# EAGLE design M_C_ext_main_ftdi (EAGLE 9.6.2)
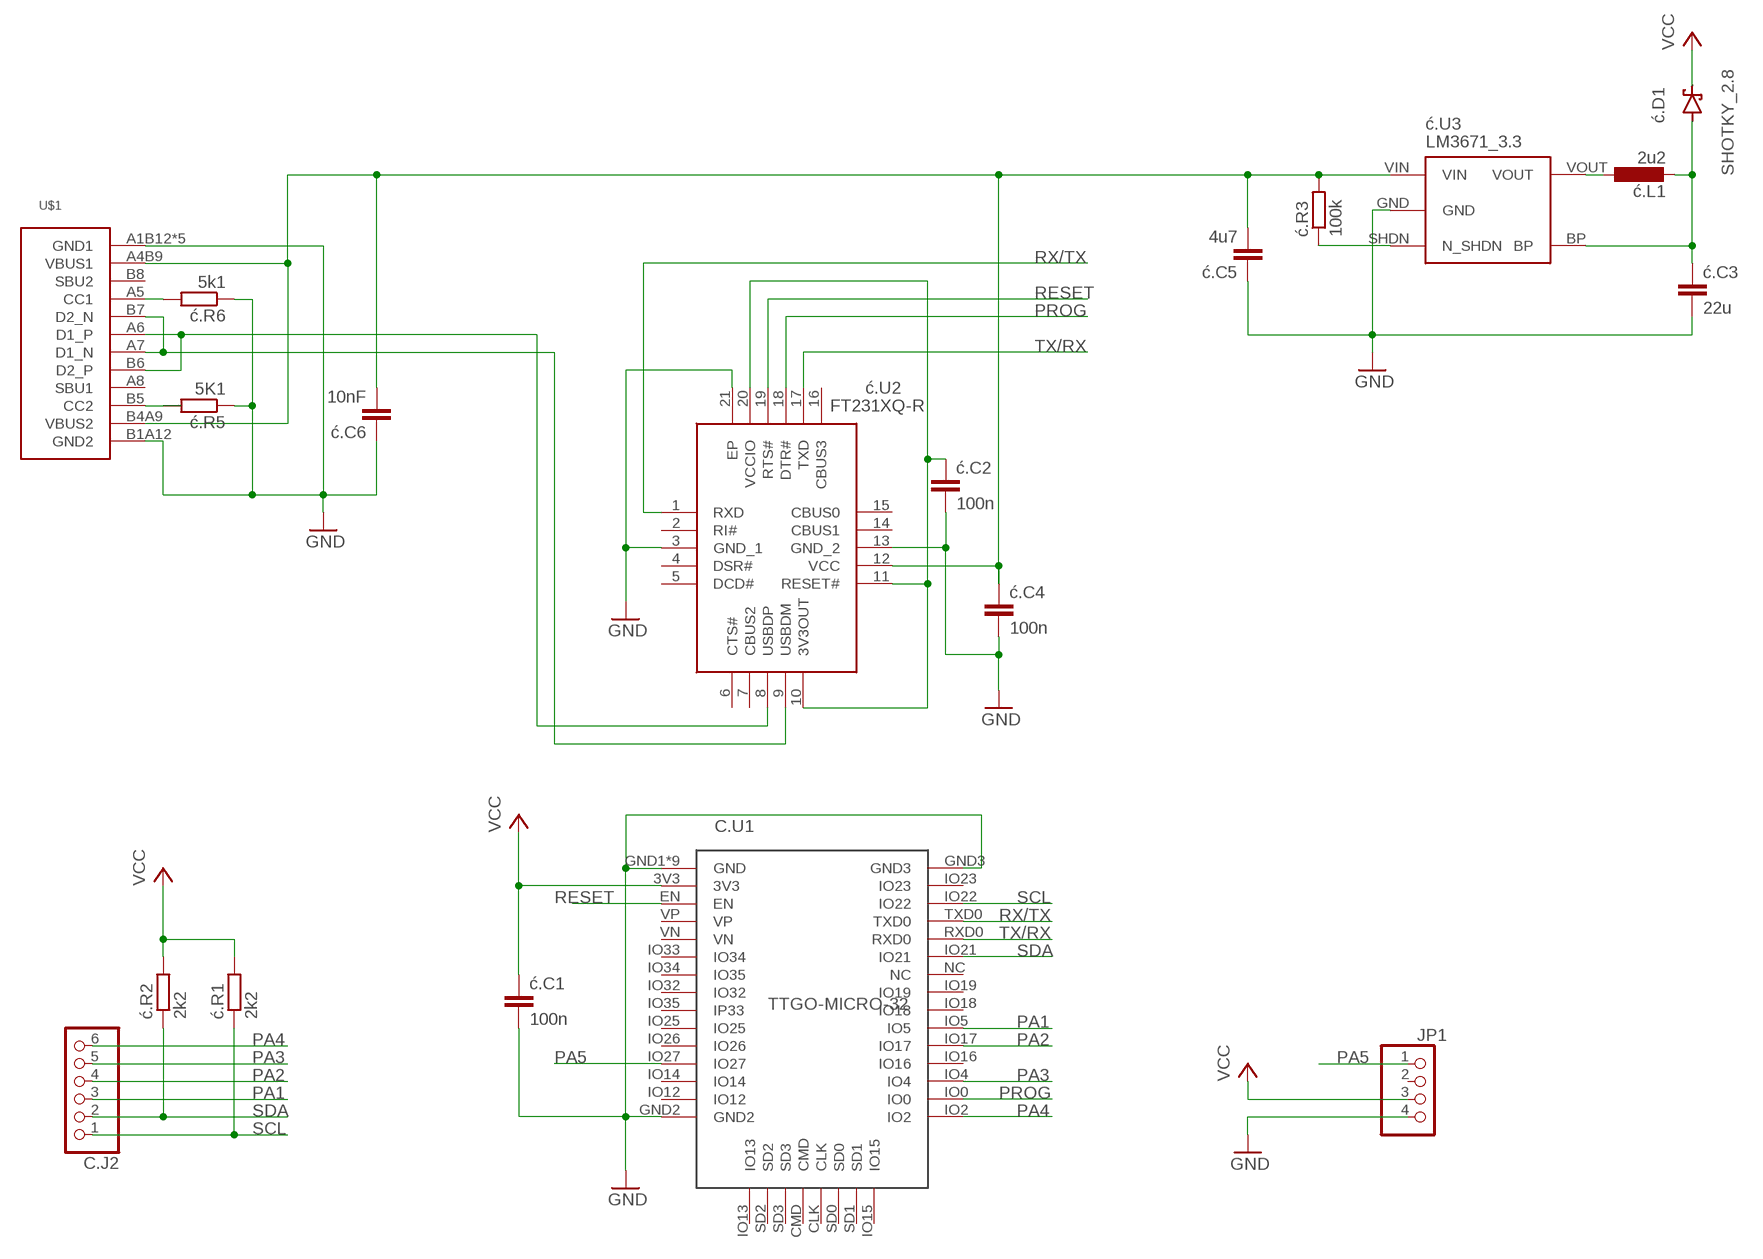
[diagram p0: schematic, sheet 1]

## Parts
C.J2  PINHD-1X6  [1X06]
C.U1  TTGO-MICRO-32  [TTGO-MICRO-32]
JP1  PINHD-1X4  [1X04]
U$1  USB-C  [USB-C]
ć.C1  100n  C-EUC0603  [C0603]
ć.C2  100n  C-EUC0603  [C0603]
ć.C3  22u  C-EUC0805  [C0805]
ć.C4  100n  C-EUC0603  [C0603]
ć.C5  4u7  C-EUC0603  [C0603]
ć.C6  10nF  C-EUC0603  [C0603]
ć.D1  SHOTKY_2.8  [SHOTKY_2.8]
ć.L1  2u2  L-EUL3230M  [L3230M]
ć.R1  2k2  R-EU_R0603  [R0603]
ć.R2  2k2  R-EU_R0603  [R0603]
ć.R3  100k  R-EU_R0603  [R0603]
ć.R5  5K1  R-EU_R0603  [R0603]
ć.R6  5k1  R-EU_R0603  [R0603]
ć.U2  FT231XQ-R  [QFN50P400X400X80-21N]
ć.U3  LM3671_3.3  STABILISER_APE8865  [SOT32-5]

## Nets
GND: C.U1.GND1(GND) C.U1.GND2 C.U1.GND3 C.U1.GND4(GND) C.U1.GND5(GND) C.U1.GND6(GND) C.U1.GND7(GND) C.U1.GND8(GND) C.U1.GND9(GND) C.U1.GND10(GND) C.U1.GND11(GND) JP1.4 U$1.A1B12(GND1) U$1.B1A12(GND2) U$1.SH1(GND1) U$1.SH2(GND1) U$1.SH3(GND1) U$1.SH4(GND1) ć.C1.2 ć.C2.2 ć.C3.2 ć.C4.2 ć.C5.1 ć.C6.1 ć.R5.1 ć.R6.1 ć.U2.3(GND_1) ć.U2.13(GND_2) ć.U2.21(EP) ć.U3.GND
N$1: U$1.A7(D1_N) U$1.B7(D2_N) ć.U2.9(USBDM)
N$2: U$1.A6(D1_P) U$1.B6(D2_P) ć.U2.8(USBDP)
N$3: U$1.A5(CC1) ć.R6.2
N$4: U$1.B5(CC2) ć.R5.2
N$5: ć.C3.1 ć.D1.A ć.L1.2 ć.U3.BP
N$10: ć.L1.1 ć.U3.VOUT
N$11: ć.R3.1 ć.U3.SHDN(N_SHDN)
N$15: ć.C2.1 ć.U2.10(3V3OUT) ć.U2.11(RESET#) ć.U2.20(VCCIO)
PA1: C.J2.3 C.U1.IO5
PA2: C.J2.4 C.U1.IO17
PA3: C.J2.5 C.U1.IO4
PA4: C.J2.6 C.U1.IO2
PA5: C.U1.IO27 JP1.1
PROG: C.U1.IO0 ć.U2.18(DTR#)
RESET: C.U1.EN ć.U2.19(RTS#)
RX/TX: C.U1.TXD0 ć.U2.1(RXD)
SCL: C.J2.1 C.U1.IO22 ć.R1.1
SDA: C.J2.2 C.U1.IO21 ć.R2.1
TX/RX: C.U1.RXD0 ć.U2.17(TXD)
VCC: C.U1.3V3 JP1.3 ć.C1.1 ć.D1.K(C) ć.R1.2 ć.R2.2
VUSB: U$1.A4B9(VBUS1) U$1.B4A9(VBUS2) ć.C4.1 ć.C5.2 ć.C6.2 ć.R3.2 ć.U2.12(VCC) ć.U3.VIN
Unconnected: C.U1.CLK C.U1.CMD C.U1.IO12 C.U1.IO13 C.U1.IO14 C.U1.IO15 C.U1.IO16 C.U1.IO18 C.U1.IO19 C.U1.IO23 C.U1.IO25 C.U1.IO26 C.U1.IO32 C.U1.IO33(IO34) C.U1.IO34(IO35) C.U1.IO35(IP33) C.U1.NC C.U1.SD0 C.U1.SD1 C.U1.SD2 C.U1.SD3 C.U1.VN C.U1.VP JP1.2 U$1.A8(SBU1) U$1.B8(SBU2) ć.U2.2(RI#) ć.U2.4(DSR#) ć.U2.5(DCD#) ć.U2.6(CTS#) ć.U2.7(CBUS2) ć.U2.14(CBUS1) ć.U2.15(CBUS0) ć.U2.16(CBUS3)

## Library data of the parts
C.J2 = pinhead2:PINHD-1X6: PIN HEADER
C.U1 = hugo:TTGO-MICRO-32
JP1 = pinhead2:PINHD-1X4: PIN HEADER
U$1 = hugo:USB-C
ć.C1-ć.C6 = rcl:C-EU: CAPACITOR, European symbol; SPICEPREFIX: C
ć.D1 = hugo:SHOTKY_2.8
ć.L1 = rcl:L-EU: INDUCTOR, European symbol; SPICEPREFIX: L
ć.R1-ć.R3 ć.R5 ć.R6 = rcl:R-EU_: RESISTOR, European symbol; SPICEPREFIX: R
ć.U2 = FT231XQ-R:FT231XQ-R: FTDI Chip FT231XQ-R, USB Transceiver Source: Datasheet <http://www.ftdichip.com/Support/Documents/DataSheets/ICs/DS_FT231X.pdf>; DESCRIPTION: FTDI Chip FT231XQ-R, USB Transceiver; HEIGHT: 0.8mm; MANUFACTURER_NAME: FTDI Chip; MANUFACTURER_PART_NUMBER: FT231XQ-R
ć.U3 = !stavebnice03:STABILISER_APE8865

## Board
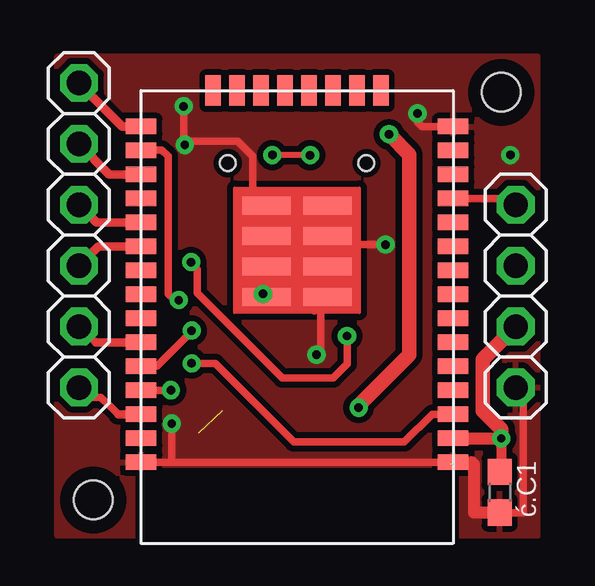
[diagram p1: board, top side]
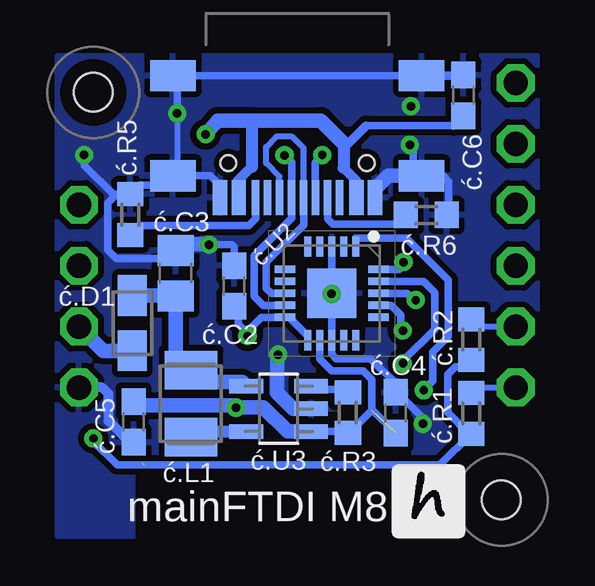
[diagram p2: board, bottom side, seen from below]

No outline drawn. Coordinates in mm, seen from the top.
Copper layers (1*16): Top 0.035mm / dielectric 1.5mm / Bottom 0.035mm
Design rules "default *": minimum track width 10mil, minimum drill 0.35mm, track to track 6mil, track to pad 6mil, pad to pad 6mil, via to via 10mil, smd to smd 10mil, copper to edge 10mil, drill to drill 40mil, minimum pad ring 10mil, minimum via ring 8mil, stop-mask expansion 4mil, vias tented up to drill 4mm, thermal gap 10mil
Holes 1.6 mm at 2,2 19,19
tRestrict: area 18,18 to 20,20; area 1,1 to 3,3
bRestrict: area 1,1 to 3,3; area 18,18 to 20,20

### Footprints (pad centres in the part's own frame; a part is rotated, then mirrored left to right if it is on the bottom)
1X06 = drill 1.016 pad 1.575 octagon: 1 -6.35,0; 2 -3.81,0; 3 -1.27,0; 4 1.27,0; 5 3.81,0; 6 6.35,0
TTGO-MICRO-32 = smd 1.27 x 0.635: 3V3 -6.5,5; EN -6.5,4; GND1 -6.5,6; GND2 -6.5,-8; GND3 6.5,6; IO0 6.5,-7; IO2 6.5,-8; IO4 6.5,-6; IO5 6.5,-3; IO12 -6.5,-7; IO14 -6.5,-6; IO16 6.5,-5; IO17 6.5,-4; IO18 6.5,-2; IO19 6.5,-1; IO21 6.5,1; IO22 6.5,4; IO23 6.5,5; IO25 -6.5,-3; IO26 -6.5,-4; IO27 -6.5,-5; IO32 -6.5,-1; IO33 -6.5,-2; IO34 -6.5,1; IO35 -6.5,0; NC 6.5,0; RXD0 6.5,2; TXD0 6.5,3; VN -6.5,2; VP -6.5,3 | smd 0.635 x 1.27: CLK 0.5,-9.5; CMD -0.5,-9.5; IO13 -3.5,-9.5; IO15 3.5,-9.5; SD0 1.5,-9.5; SD1 2.5,-9.5; SD2 -2.5,-9.5; SD3 -1.5,-9.5 | smd 2.032 x 0.762: GND4 -1.27,-0.889; GND5 1.27,-0.889; GND6 -1.27,-2.159; GND7 1.27,-2.159; GND8 -1.27,-3.429; GND9 -1.27,-4.699; GND10 1.27,-3.429; GND11 1.27,-4.699
1X04 = drill 1.016 pad 1.575 octagon: 1 -3.81,0; 2 -1.27,0; 3 1.27,0; 4 3.81,0
USB-C = smd 0.6 x 1.45: A1B12 -3.235,3.825; A4B9 -2.46,3.825; B1A12 3.215,3.825; B4A9 2.44,3.825 | smd 0.3 x 1.45: A5 -1.26,3.825; A6 -0.26,3.825; A7 0.24,3.825; A8 1.24,3.825; B5 1.74,3.825; B6 0.74,3.825; B7 -0.76,3.825; B8 -1.76,3.825 | smd 1.9 x 1.3: SH1 -5.18,2.91; SH2 -5.18,-1.27; SH3 5.18,-1.27; SH4 5.18,2.91 | hole 0.65: 2.88,2.38; -2.9,2.38
C0603 = smd 1.1 x 1: 1 -0.85,0; 2 0.85,0
C0805 = smd 1.3 x 1.5: 1 -0.95,0; 2 0.95,0
SHOTKY_2.8 = smd 1.7 x 1.2: A -1.15,0; K 1.15,0
L3230M = smd 1.6 x 2.2: 1 -1.4,0; 2 1.4,0
R0603 = smd 1 x 1.1: 1 -0.85,0; 2 0.85,0
QFN50P400X400X80-21N = smd 0.85 x 0.3: 1 -1.95,1; 2 -1.95,0.5; 3 -1.95,0; 4 -1.95,-0.5; 5 -1.95,-1; 11 1.95,-1; 12 1.95,-0.5; 13 1.95,0; 14 1.95,0.5; 15 1.95,1 | smd 0.3 x 0.85: 6 -1,-1.95; 7 -0.5,-1.95; 8 0,-1.95; 9 0.5,-1.95; 10 1,-1.95; 16 1,1.95; 17 0.5,1.95; 18 0,1.95; 19 -0.5,1.95; 20 -1,1.95 | smd 2.05 x 2.05: 21 0,0
SOT32-5 = smd 0.6 x 1.4: BP 0.95,1.35; GND 0,-1.35; SHDN 0.95,-1.35; VIN -0.95,-1.35; VOUT -0.95,1.35

### Placement (x,y rotation side)
C.J2  1.4,13.04 90 top
C.U1  10.49,9.58 180 top
JP1  19.6,10.5 270 top
U$1  10.5,18.43 180 bottom
ć.C1  18.93,2.32 270 top
ć.C2  13.13,10.92 90 bottom
ć.C3  15.57,11.45 90 bottom
ć.C4  6.4,5.64 90 bottom
ć.C5  17.32,5.26 90 bottom
ć.C6  3.58,18.87 270 bottom
ć.D1  17.37,9.37 270 bottom
ć.L1  14.93,6.02 90 bottom
ć.R1  3.25,5.61 270 bottom
ć.R2  3.25,8.68 270 bottom
ć.R3  8.39,5.64 270 bottom
ć.R5  17.46,13.9 270 bottom
ć.R6  5.13,13.89 180 bottom
ć.U2  9.07,10.62 270 bottom
ć.U3  11.28,5.8 90 bottom

### Tracks (layer width: path | path; a pad name or v marks a point on that pad's centre or on a via)
GND  (via drill 0.35)  (1 unrouted)
  Top 0.254: v11.3,8.05 11.48,8.23 | C.U1.GND4 C.U1.GND6 C.U1.GND8 C.U1.GND9 | C.U1.GND11 9.22,13.99 | 9.22,13.99 9.22,13.64 C.U1.GND10 C.U1.GND7 C.U1.GND5 C.U1.GND4 | C.U1.GND4 11.2,9.91 11.2,9.88 | 8.65,14.79 8.65,14.57 9.22,13.99
  Top 0.305: C.U1.GND2 15.72,17.58 15.71,17.57 15.51,17.77 v15.51,18.12 15.51,17.97 | C.U1.GND3 5.36,3.58 | 5.9,16.87 v5.81,16.81 | v5.81,16.81 5.81,17.04 | 18.93,1.49 ć.C1.2 19.91,1.47 19.91,6.38 JP1.4 | 16.88,3.46 16.85,3.46 16.78,3.53 | v5.81,16.81 6,16.97 8.01,16.97 8.65,16.33 8.65,14.79 | v11.3,8.05 11.15,8.24 | 11.48,8.23 11.48,10.34 11.2,10.62 | 11.2,9.88 11.2,10.62 | 11.2,10.62 11.2,11.6 | v14.18,12.65 11.76,12.65 10.77,13.64 9.22,13.64 | 5.36,3.58 C.U1.GND1 17.76,3.58 | v5.27,5.18 5.27,3.67 5.36,3.58 | v5.81,16.81 5.77,16.82 v5.77,18.41
  Top 0.508: ć.C1.2 17.86,1.47 17.86,3.48 17.76,3.58
  Bottom 0.254: v15.51,18.12 15.51,15.57 U$1.SH4 | ć.U3.GND 9.96,5.84 | 4.13,13.64 ć.R6.1
  Bottom 0.305: 15.49,18.12 v15.51,18.12 | v5.81,16.81 5.68,16.64 5.68,15.4 | v15.51,18.12 15.51,19.65 U$1.SH3 U$1.SH2 | 15.32,15.52 U$1.SH4 | 5.66,15.28 U$1.SH1 4.42,15.52 4.18,15.28 4.18,13.99 ć.R6.1 | 15.56,18.07 v15.51,18.12 | U$1.B1A12 13.71,15.05 | 13.71,15.05 13.71,15.11 14.12,15.52 U$1.SH4 | 13.71,15.05 13.73,15.06 | v5.27,5.18 5.27,5.43 6.33,6.49 ć.C4.2 6.4,6.86 7.43,7.89 8.87,7.89 9.07,8.09 ć.U2.13 v9.07,10.59 ć.U2.21 ć.U2.3 | 13.49,11.42 ć.C2.2 13.13,12.55 13.23,12.65 v14.18,12.65 | U$1.SH4 16.06,15.14 17.07,15.14 ć.R5.1 | ć.R5.1 18.18,14.75 19.38,15.95 v19.38,16.38 | ć.C3.2 15.74,12.4 16.07,12.07 18.04,12.07 18.39,12.42 18.39,14.39 18.03,14.75 ć.R5.1
  Bottom 0.356: ć.C6.1 3.6,19.7 U$1.SH2
  Bottom 0.406: 17.53,4.41 ć.C5.1 17.48,4.41 18.36,5.3 18.36,6.43 18.63,6.69 JP1.4
  Bottom 0.508: ć.U3.GND 9.94,5.82
  Bottom 0.61: v11.3,8.05 11.33,8.03 11.33,6.46 10.66,5.8 ć.U3.GND | U$1.SH1 6.7,15.52 7.26,14.96 U$1.A1B12 | ć.C3.2 15.29,12.68 14.21,12.68 v14.18,12.65
  pour Top (isolate 0.254): 0.5,0.5 0.5,20.5 20.5,20.5 20.5,0.5
  pour Bottom (isolate 0.254): 0.5,20.5 20.5,20.5 20.5,0.5 0.5,0.5
N$1  (via drill 0.35)
  Top 0.254: v11.03,16.38 v9.46,16.38
  Top 0.305: v11.04,16.38 v11.03,16.38
  Bottom 0.305: ć.U2.9 11.92,10.11 12.29,10.49 12.29,12.19 10.73,13.75 U$1.A7 10.74,16.08 v11.04,16.38 | U$1.B7 9.75,16.07 9.46,16.35 v9.46,16.38
N$2
  Bottom 0.254: U$1.A6 10.24,16.68 10.7,17.14 11.38,17.14 11.8,16.72 11.8,16.04 11.25,15.49 11.25,14.61 U$1.B6
  Bottom 0.305: U$1.A6 10.24,13.46 11.79,11.93 11.79,10.83 11.57,10.61 ć.U2.8
N$3
  Bottom 0.254: 9.24,13.83 U$1.A5 | ć.R6.2 6.3,14.11
  Bottom 0.305: ć.R6.2 5.98,13.87 6.36,13.5 9.02,13.5 9.24,13.72 9.24,13.83
N$4
  Bottom 0.254: U$1.B5 12.27,14.58
  Bottom 0.305: U$1.B5 12.23,13.73 12.52,13.44 17.07,13.44 ć.R5.2 17.46,13.15 17.3,13.31
N$5
  Bottom 0.61: ć.U3.BP 12.79,6.91 14.42,6.91 ć.L1.2 15.57,8.06 ć.C3.1 15.59,10.52 ć.D1.A
N$10
  Bottom 0.305: 12.66,4.85 ć.U3.VOUT
  Bottom 0.508: ć.L1.1 14.69,4.86 12.64,4.86 ć.U3.VOUT
N$11
  Bottom 0.305: ć.U3.SHDN 9.79,6.62 8.52,6.62 ć.R3.1
N$15  (via drill 0.35)
  Top 0.305: v12.57,8.84 12.57,7.67 11.99,7.09 9.87,7.09 6.32,10.64 6.32,11.62 6.08,11.87 v6.08,11.91
  Bottom 0.305: v6.08,11.91 6.08,11.79 6.25,11.62 ć.U2.20 | ć.U2.11 10.07,8.85 10.84,9.62 ć.U2.10 12,9.62 12.57,9.04 v12.57,8.84 12.57,8.97 12.95,9.35 12.95,9.89 ć.C2.1
PA1
  Top 0.356: C.U1.IO5 2.21,12.58 C.J2.3
PA2
  Top 0.356: C.U1.IO17 2.13,13.58 C.J2.4
PA3
  Top 0.356: C.U1.IO4 2.67,15.58 C.J2.5
PA4
  Top 0.356: C.U1.IO2 3.21,17.58 C.J2.6
PA5
  Top 0.305: JP1.1 19.35,14.56 17,14.56
  Top 0.356: 17,14.56 C.U1.IO27
PROG  (via drill 0.35)
  Top 0.305: 4.32,16.58 4.33,16.59 4.86,16.59 5.12,16.33 5.12,10.59 5.38,10.34 v5.56,10.34
  Top 0.356: C.U1.IO0 4.32,16.58
  Bottom 0.305: v5.56,10.34 5.64,10.34 5.92,10.61 ć.U2.18
RESET  (via drill 0.35)
  Top 0.305: v6.1,7.7 7.08,7.7 10.36,4.42 14.95,4.42 16.11,5.58 C.U1.EN
  Bottom 0.305: ć.U2.19 5.24,11.12 4.78,10.66 4.78,9.12 6.1,7.8 v6.1,7.7
RX/TX  (via drill 0.35)
  Top 0.305: 5.21,6.56 v5.23,6.58 C.U1.TXD0
  Bottom 0.254: 5.23,6.69 v5.23,6.58
  Bottom 0.305: ć.U2.1 8.07,12.93 5.97,12.93 4.21,11.17 4.21,8.82 4.85,8.18 4.85,6.96 v5.23,6.58
SCL
  Top 0.305: 3.04,5.58 2.69,5.93 2.31,6.28 1.81,6.28 C.J2.1
  Top 0.356: 3.04,5.58 C.U1.IO22
  Bottom 0.254: ć.R1.1 3.02,6.69 C.J2.1
SDA
  Top 0.305: 2.1,8.58 C.J2.2 | C.U1.IO21
  Top 0.356: C.U1.IO21 2.1,8.58
  Bottom 0.254: ć.R2.1 3.25,9.23 C.J2.2
TX/RX  (via drill 0.35)
  Top 0.305: v6.1,9.06 6.1,9.02 4.66,7.58 C.U1.RXD0
  Bottom 0.305: ć.U2.17 6.59,10.12 6.2,9.72 6.2,9.16 v6.1,9.06
VCC  (via drill 0.35)
  Top 0.406: 17,4.56 C.U1.3V3 | 18.98,4.57 v19,4.57 v19.01,4.56 19.01,3.25 ć.C1.1
  Top 0.508: C.U1.3V3 v18.99,4.58 v19,4.57
  Top 0.61: v19,4.57 19,4.95 18.24,5.71 18.24,7.87 JP1.3
  Bottom 0.254: 3.42,4.43 ć.R1.2 | 3.45,7.82 ć.R2.2
  Bottom 0.305: ć.R1.2 3.48,4.99 | ć.R2.2 3.53,7.55 3.93,7.55 4.24,7.24 4.24,5.64 3.35,4.76 ć.R1.2 | ć.R1.2 4.56,3.46 18,3.46 19,4.45 v19,4.57
  Bottom 0.508: 19.09,4.48 v19,4.57
  Bottom 0.61: ć.D1.K 18.59,8.22 JP1.3
VUSB  (via drill 0.35)  (1 unrouted)
  Top 0.61: v13.06,5.85 13.06,5.95 15.16,8.05 15.16,16.41 v14.32,17.25 14.34,17.29
  Bottom 0.254: 9.86,4.92 ć.U3.VIN
  Bottom 0.305: ć.C4.1 7.39,5.78 7.39,7.02 7.75,7.38 9.07,7.38 9.57,7.89 ć.U2.12 | 9.77,4.7 ć.U3.VIN 8.45,4.85 ć.R3.2 8.26,4.92 8.22,4.92 7.39,5.74 | U$1.B4A9 12.94,14.87 12.97,14.9 12.97,15.32 | 7.62,17.6 4,17.6 | 8.06,15.33 8.06,14.62 U$1.A4B9
  Bottom 0.356: ć.C6.2 4,17.6 | 7.62,17.6 8.47,16.75 8.53,16.82 8.81,17.09 8.81,17.12
  Bottom 0.406: 12.97,15.32 12.39,15.9 | 8.57,15.84 8.06,15.33
  Bottom 0.508: 12.39,17.82 12.39,15.9 | 8.53,16.82 8.57,16.78 8.57,15.84
  Bottom 0.61: ć.U3.VIN 10.9,4.85 11.91,5.86 13.04,5.86 v13.06,5.85 13.16,5.95 17.17,5.95 ć.C5.2 17.37,6.16 | v14.32,17.25 13.82,17.82 12.39,17.82 9.52,17.82 8.81,17.12 8.53,16.84

### Text on the board
bPlace: mainFTDI M8